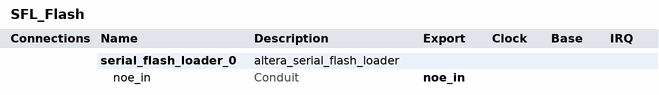
[diagram p0: system contents]
# Platform Designer (Qsys) system SFL_Flash, Cyclone IV E EP4CE10E22C8
# Parameters at their usual value, and those the tool derives, are not listed.
package require -exact qsys 17.1
create_system SFL_Flash
set_project_property DEVICE_FAMILY {Cyclone IV E}
set_project_property DEVICE EP4CE10E22C8

add_instance serial_flash_loader_0 altera_serial_flash_loader 17.1
set_instance_property serial_flash_loader_0 AUTO_EXPORT true
set_instance_parameter_value serial_flash_loader_0 ENHANCED_MODE true
set_instance_parameter_value serial_flash_loader_0 gui_shared_access false

# exported interfaces
add_interface noe_in conduit end
set_interface_property noe_in EXPORT_OF serial_flash_loader_0.noe_in

set_interconnect_requirement {$system} qsys_mm.clockCrossingAdapter HANDSHAKE
set_interconnect_requirement {$system} qsys_mm.enableEccProtection FALSE
set_interconnect_requirement {$system} qsys_mm.insertDefaultSlave FALSE
set_interconnect_requirement {$system} qsys_mm.maxAdditionalLatency 1

save_system SFL_Flash.qsys
